# EAGLE design microphone proto routed (EAGLE 7.4.0)
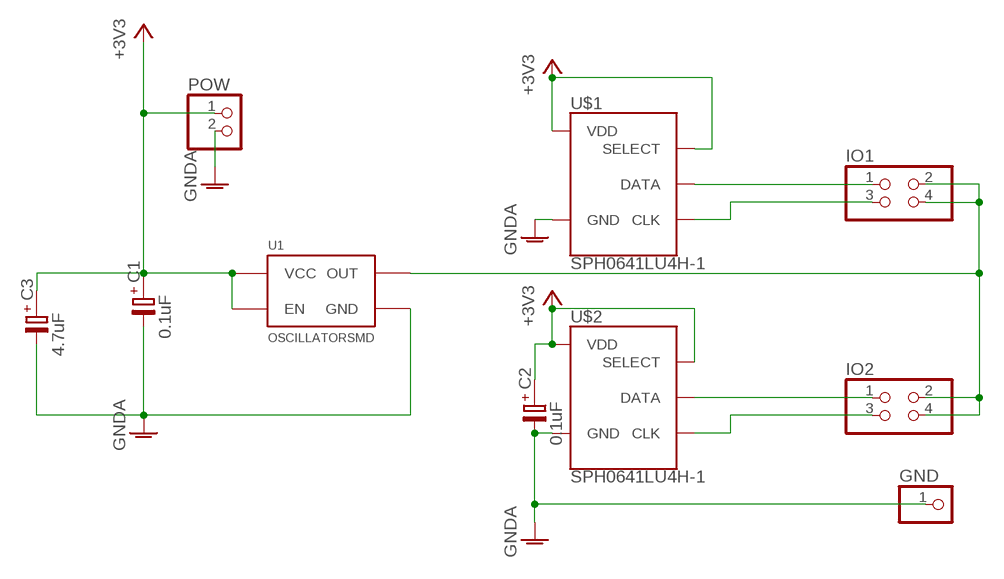
[diagram p0: schematic, sheet 1]

## Parts
C1  0.1uF  CPOL0805  [0805]
C2  0.1uF  CPOL0805  [0805]
C3  4.7uF  CPOLA  [TE-A-3216]
GND  PINHD-1X1  [1X01]
IO1  PINHD-2X2  [2X02]
IO2  PINHD-2X2  [2X02]
POW  PINHD-1X2  [1X02]
U1  OSCILLATORSMD  [CRYSTAL-SMD-7X5]
U$1  SPH0641LU4H-1  [SPH0641LU4H-1]
U$2  SPH0641LU4H-1  [SPH0641LU4H-1]

## Nets
+3V3: C1.+ C2.+ C3.+ POW.1 U1.P$1(EN) U1.P$4(VCC) U$1.2(SELECT) U$1.5(VDD) U$2.2(SELECT) U$2.5(VDD)
GNDA: C1.- C2.- C3.- GND.1 POW.2 U1.P$2(GND) U$1.3(GND) U$2.3(GND)
N$1: IO1.1 U$1.1(DATA)
N$2: IO1.3 U$1.4(CLK)
N$3: IO1.2 IO1.4 IO2.2 IO2.4 U1.P$3(OUT)
N$4: IO2.1 U$2.1(DATA)
N$5: IO2.3 U$2.4(CLK)

## Library data of the parts
C1-C3 = filip:CPOL: polarized SMD caps Size A 3.2x1.6, Size B 3.5x2.8, Size C 6.0x3.2, Size D (or N) 7.3x4.3 0805 United Chem E60 5x5.7, F60 6.3x5.7, H70 8x6.7 or HA0
GND = pinhead:PINHD-1X1: PIN HEADER
IO1 IO2 = pinhead:PINHD-2X2: PIN HEADER
POW = pinhead:PINHD-1X2: PIN HEADER
U1 = filip:OSCILLATOR: Generic 5x3 and 7x5 oscillators
U$1 U$2 = filip:SPH0641LU4H-1: Knowles MEMS microphone - ultrasonic range

## Board
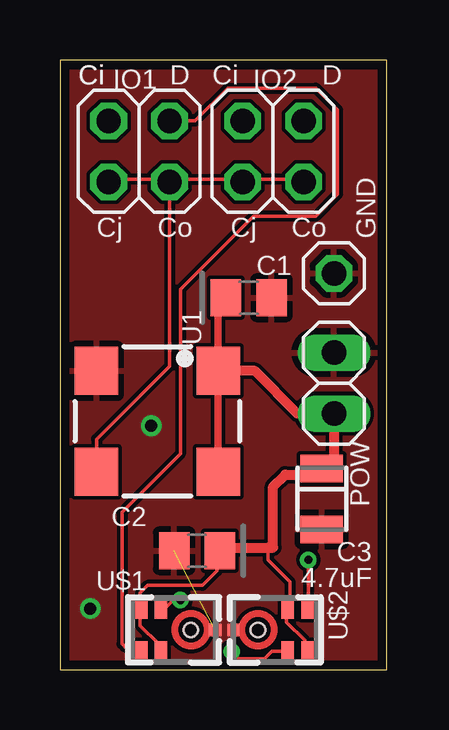
[diagram p1: board, top side]
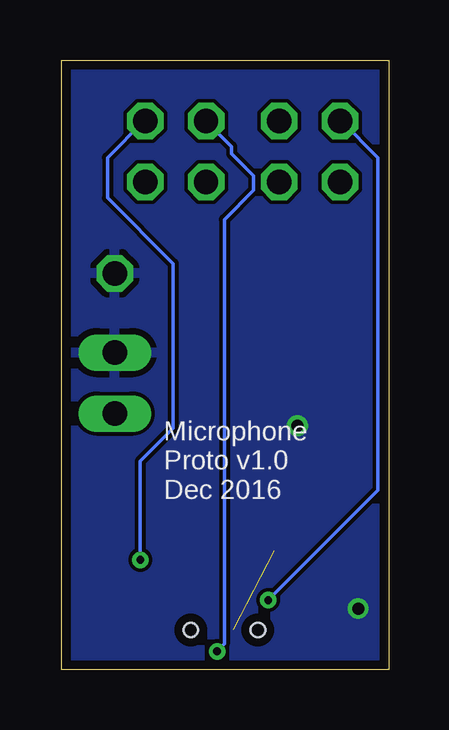
[diagram p2: board, bottom side, seen from below]

Size 13.64 x 25.4 mm. Coordinates in mm from the lower left corner, seen from the top.
Outline: 0,0 13.64,0 13.64,25.4 0,25.4 0,0
Copper layers (1*16): Top 0.0356mm / dielectric 1.5011mm / Bottom 0.0356mm
Design rules "OSH Parks LaenPCBOrder *": minimum track width 6mil, minimum drill 13mil, track to track 6mil, track to pad 6mil, pad to pad 6mil, via to via 6mil, smd to smd 6mil, copper to edge 15mil, drill to drill 6mil, minimum pad ring 7mil, minimum via ring 7mil, stop-mask expansion 3mil, vias tented up to drill 0mil, thermal gap 10mil

### Footprints (pad centres in the part's own frame; a part is rotated, then mirrored left to right if it is on the bottom)
0805 = smd 1.27 x 1.524: + -0.953,0; - 0.953,0
TE-A-3216 = smd 1.143 x 1.778: + 1.27,0; - -1.27,0
1X01 = drill 1.016 octagon: 1 0,0
2X02 = drill 1.016 octagon: 1 -1.27,-1.27; 2 -1.27,1.27; 3 1.27,-1.27; 4 1.27,1.27
1X02 = drill 1.016 long: 1 -1.27,0; 2 1.27,0
CRYSTAL-SMD-7X5 = smd 1.8 x 2: P$1 0,0; P$2 5.08,0; P$3 5.08,4.2; P$4 0,4.2
SPH0641LU4H-1 = smd 0.725 x 0.522: 1 -0.838,2.074; 2 -0.838,1.252; 4 0.838,1.252; 5 0.838,2.074 | smd 0.508 x 0.508: 3 0,-1.016 | hole 0.6: 0,0

### Placement (x,y rotation side)
C1  7.87,15.49 0 top
C2  5.71,4.95 180 top
C3  10.92,7.11 90 top
GND  11.43,16.51 0 top
IO1  3.3,21.59 180 top
IO2  8.89,21.59 180 top
POW  11.43,11.94 90 top
U1  6.6,12.45 180 top
U$1  5.46,1.65 90 top
U$2  8.26,1.65 270 top

### Tracks (layer width: path | path; a pad name or v marks a point on that pad's centre or on a via)
+3V3
  Top 0.152: U$1.2 4.12,0.91 4.12,1.07 3.35,1.83 3.35,2.44 U$1.5 3.35,2.59 3.35,3.2 3.66,3.5 5.94,3.5 6.55,4.12 6.55,4.88 C2.+ | 8.69,5.08 8.69,4.57 9.6,3.66 9.6,2.59 U$2.2 9.45,2.44 9.45,1.98 10.21,1.22 10.21,0.91 U$2.5
  Top 0.305: C1.+ 6.6,15.18 U1.P$1 U1.P$4 | 11.43,8.89 C3.+ 10.67,8.13
  Top 0.406: U1.P$1 8.13,12.45 9.91,10.67 POW.1 11.43,8.89 | 10.67,8.13 9.4,8.13 8.89,7.62 8.89,5.08 8.69,5.08 6.79,5.08 C2.+
GNDA  (via drill 0.5)  (1 unrouted)
  other vias: 3.81,10.16 1.27,2.54
  pour Top: 0,25.4 13.46,25.4 13.46,0.25 0,0.25
  pour Bottom: 0,25.15 13.46,25.15 13.46,0 0,0
N$1
  Top 0.152: IO1.1 5.64,22.86 7.01,24.23 10.67,24.23 11.58,23.32 11.58,19.81 10.67,18.9 8.08,18.9 5.03,15.85 5.03,8.99 2.59,6.55 2.59,1.07 2.74,0.91 3.35,0.91 U$1.1
N$2  (via drill 0.33)
  Top 0.152: v5.03,2.9 4.88,3.05 4.42,2.59 4.27,2.59 U$1.4
  Bottom 0.152: v5.03,2.9 0.46,7.47 0.46,21.34 1.98,22.86 IO1.3
N$3
  Top 0.152: 7.62,20.42 10.06,20.42 IO2.2 | U1.P$3 1.52,9.6 4.57,12.65 IO1.2 4.57,20.42 | 4.57,20.42 2.13,20.42 IO1.4 | 4.57,20.42 7.62,20.42 | 7.62,20.42 IO2.4
N$4  (via drill 0.33)
  Top 0.152: v10.36,4.57 10.36,2.59 U$2.1
  Bottom 0.152: v10.36,4.57 10.36,8.69 8.99,10.06 8.99,16.92 11.73,19.66 11.73,21.34 10.21,22.86 IO2.1
N$5  (via drill 0.33)
  Top 0.152: v7.16,0.76 7.47,0.46 8.53,0.46 8.84,0.76 9.45,0.76 U$2.4
  Bottom 0.152: v7.16,0.76 6.86,1.07 6.86,18.75 5.64,19.96 5.64,20.57 6.55,21.49 6.55,21.79 IO2.3

### Text on the board
tNames: Ci | Ci | D | Ci | D | Cj | Co | Cj | Co
bNames: Microphone / Proto v1.0 / Dec 2016